# Altium schematic sheet RFID_transmitter_V2.SchDoc
size A
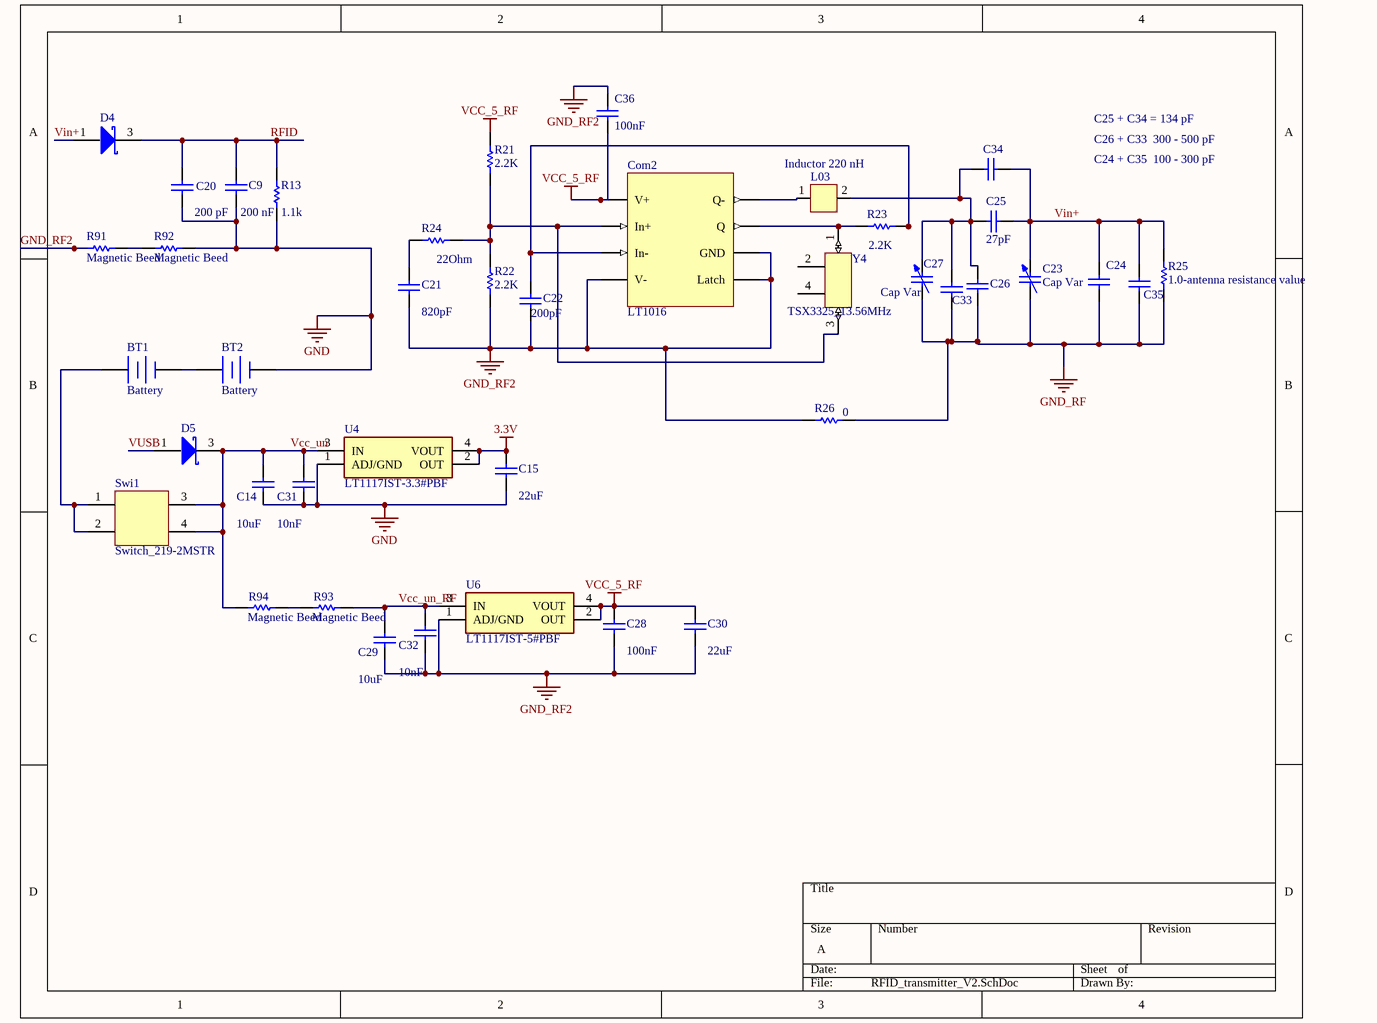
[diagram p0: RFID_transmitter_V2.SchDoc]

## Parts
BT1  Battery  [Battery]
BT2  Battery  [Battery]
C9  value 200 nF  [0603]  (hidden comment: Cap 10n)
C14  value 10uF  [0603]  (hidden comment: Cap 10u)
C15  value 22uF  [0603]  (hidden comment: Cap 22u)
C20  value 200 pF  [0603]  (hidden comment: Cap 4.7n)
C21  value 820pF  [0603]  (hidden comment: Cap 820p)
C22  value 200pF  [0603]  (hidden comment: Cap 200p)
C23  Cap Var  [Variable_Capacitor_JZ400HV1]
C24  Cap  [0603]  (value not drawn)
C25  value 27pF  [0603]  (hidden comment: Cap)
C26  random value needs carefully address  [0603]  (value not drawn)
C27  Cap Var  [Variable_Capacitor_JZ400HV1]
C28  value 100nF  [0603]  (hidden comment: Cap 100n)
C29  value 10uF  [0603]  (hidden comment: Cap 10u)
C30  value 22uF  [0603]  (hidden comment: Cap 22u)
C31  value 10nF  [0603]  (hidden comment: Cap 10n)
C32  value 10nF  [0603]  (hidden comment: Cap 10n)
C33  random value needs carefully address  [0603]  (value not drawn)
C34  Cap  [0603]  (value not drawn)
C35  Cap  [0603]  (value not drawn)
C36  value 100nF  [1608[0603]]  (hidden comment: GRM188R61A226ME15D)
Com2  LT1016  [LT1016_SOIC]
D4  SMMBD301LT3G  [SOT96P237X111-3N]  (value not drawn)
D5  SMMBD301LT3G  [SOT96P237X111-3N]  (value not drawn)
L03  Inductor 220 nH  [Ferrite_bead_0805inch_2012mm]
R13  value 1.1k  [0603]  (hidden comment: Res1)
R21  value 2.2K  [0603]  (hidden comment: Res1 2.2k)
R22  value 2.2K  [0603]  (hidden comment: Res1 2.2k)
R23  value 2.2K  [0603]  (hidden comment: Res1 2.2k)
R24  value 22Ohm  [0603]  (hidden comment: Res1 22)
R25  value 1.0-antenna resistance value  [0603]
R26  value 0  [0603]  (hidden comment: Magnetic Beed)
R91  Magnetic Beed  [0603]
R92  Magnetic Beed  [0603]
R93  Magnetic Beed  [0603]
R94  Magnetic Beed  [0603]
Swi1  Switch_219-2MSTR  [Switch_219-2MSTR]
U4  LT1117IST-3.3#PBF  [SOT230P700X180-4N]
U6  LT1117IST-5#PBF  [SOT230P700X180-4N]
Y4  TSX3325_13.56MHz  [HC_49Crystal]

## Nets
3.3V: C15.2 U4.2(OUT) U4.4(VOUT)
GND: BT2.2(-) C9.1 C14.1 C15.1 C20.1 C31.1 R13.1 R92.2 U4.1(ADJ/GND)
GND_RF: C23.1 C24.1 C26.2 C27.1 C33.2 C35.1 R25.1 R26.2
GND_RF2: C21.1 C22.1 C28.1 C29.1 C30.1 C32.1 C36.2 Com2.4(V-) Com2.5(Latch) Com2.6(GND) R22.1 R26.1 R91.1 U6.1(ADJ/GND)
VCC_5_RF: C28.2 C30.2 C36.1 Com2.1(V+) R21.2 U6.2(OUT) U6.4(VOUT)
RFID: C9.2 C20.2 D4.3(CATHODE) R13.2
Vcc_un: C14.2 C31.2 D5.3(CATHODE) R94.1 Swi1.3(Out1) Swi1.4(Out2) U4.3(IN)
Vcc_un_RF: C29.2 C32.2 R93.2 U6.3(IN)
Vin+: C23.2 C24.2 C25.1 C34.1 C35.2 D4.1(ANODE) R25.2
VUSB: D5.1(ANODE)
NetBT1_1: BT1.1(+) Swi1.1(In1) Swi1.2(In2)
NetBT1_2: BT1.2(-) BT2.1(+)
NetC21_2: C21.2 R24.1
NetC22_2: C22.2 Com2.3(In-) R23.2
NetC25_2: C25.2 C26.1 C27.2 C33.1 C34.2 L03.2
NetCom2_2: Com2.2(In+) R21.1 R22.2 R24.2 Y4.3(Out)
NetCom2_7: Com2.7(Q) R23.1 Y4.1(In)
NetCom2_8: Com2.8(Q-) L03.1
NetR91_2: R91.2 R92.1
NetR93_1: R93.1 R94.2

Not connected (* = marked no-connect by the designer): Y4 2(GND) 4(GND)

## Notes on the sheet
- C25 + C34 = 134 pF
- C26 + C33  300 - 500 pF
- C24 + C35  100 - 300 pF

## Library data of the parts
BT1 BT2 = Battery: Multicell Battery; Published: 24-Mar-1999; LatestRevisionDate: 17-Jul-2002; LatestRevisionNote: Re-released for DXP Platform.; PackageReference: BAT-2; Publisher: Altium Limited; PackageDescription: Battery; 2 Leads
C9 C14 C15 C20-C22 C28-C32 = Cap: Capacitor; Published: 8-Jun-2000; LatestRevisionDate: 17-Jul-2002; LatestRevisionNote: Re-released for DXP Platform.; PackageReference: RAD-0.3; Publisher: Altium Limited; PackageDescription: Radial Cap, Thru-Hole; 2 Leads; 0.3 in Pin Spacing
C23 C27 = Cap Var: Variable or Adjustable Capacitor; Value: 100pF; Published: 24-Mar-1999; LatestRevisionDate: 29-May-2009; LatestRevisionNote: IPC-7351 Footprint Added.; PackageReference: C1210; Publisher: Altium Limited; PackageDescription: Chip Capacitor 1210 Case Size; Code_JEITA: 1210; Code_IPC: CAPC3225
C24 = Cap: Capacitor_for resonance; Value: 22pF; Published: 8-Jun-2000; LatestRevisionDate: 17-Jul-2002; LatestRevisionNote: Re-released for DXP Platform.; PackageReference: RAD-0.3; Publisher: Altium Limited; PackageDescription: Radial Cap, Thru-Hole; 2 Leads; 0.3 in Pin Spacing
C25 = Cap: Capacitor_for resonance; Published: 8-Jun-2000; LatestRevisionDate: 17-Jul-2002; LatestRevisionNote: Re-released for DXP Platform.; PackageReference: RAD-0.3; Publisher: Altium Limited; PackageDescription: Radial Cap, Thru-Hole; 2 Leads; 0.3 in Pin Spacing
C26 = Cap: Capacitor_for resonance; Value: 470pF; Published: 8-Jun-2000; LatestRevisionDate: 17-Jul-2002; LatestRevisionNote: Re-released for DXP Platform.; PackageReference: RAD-0.3; Publisher: Altium Limited; PackageDescription: Radial Cap, Thru-Hole; 2 Leads; 0.3 in Pin Spacing
C33-C35 = Cap: Capacitor_for resonance; Value: 1pF; Published: 8-Jun-2000; LatestRevisionDate: 17-Jul-2002; LatestRevisionNote: Re-released for DXP Platform.; PackageReference: RAD-0.3; Publisher: Altium Limited; PackageDescription: Radial Cap, Thru-Hole; 2 Leads; 0.3 in Pin Spacing
C36 = Cap Semi: Capacitor (Semiconductor SIM Model); Voltage: 10V; Published: 8-Jun-2000; LatestRevisionDate: 29-May-2009; LatestRevisionNote: IPC-7351 Footprint Added.; PackageReference: C1206; Publisher: Altium Limited; PackageDescription: Chip Capacitor
D4 D5 = SMMBD301LT3G: Schottky Barrier Diodes; Manufacturer_Name: ON Semiconductor; Datasheet Link: https://altium.componentsearchengine.com/Datasheets/1/SMMBD301LT3G.pdf; Height: 1.11mm; Manufacturer_Part_Number: SMMBD301LT3G
L03 = Component_1: 220nH
R13 R21-R25 = Res1: Resistor; Published: 8-Jun-2000; LatestRevisionDate: 17-Jul-2002; LatestRevisionNote: Re-released for DXP Platform.; PackageReference: AXIAL-0.3; Publisher: Altium Limited; PackageDescription: Axial Device, Thru-Hole; 2 Leads; 0.3 in Pin Spacing
R26 = Res1: Wurth Magnetic Bead; Published: 8-Jun-2000; LatestRevisionDate: 17-Jul-2002; LatestRevisionNote: Re-released for DXP Platform.; PackageReference: AXIAL-0.3; Publisher: Altium Limited; PackageDescription: Axial Device, Thru-Hole; 2 Leads; 0.3 in Pin Spacing
R91 R92 = Res1: Wurth Magnetic Bead; Value: 0; Published: 8-Jun-2000; LatestRevisionDate: 17-Jul-2002; LatestRevisionNote: Re-released for DXP Platform.; PackageReference: AXIAL-0.3; Publisher: Altium Limited; PackageDescription: Axial Device, Thru-Hole; 2 Leads; 0.3 in Pin Spacing
R93 R94 = Res1: Resistor; Value: 0 Ohm; Published: 8-Jun-2000; LatestRevisionDate: 17-Jul-2002; LatestRevisionNote: Re-released for DXP Platform.; PackageReference: AXIAL-0.3; Publisher: Altium Limited; PackageDescription: Axial Device, Thru-Hole; 2 Leads; 0.3 in Pin Spacing
U4 = LT1117IST-3.3#PBF: Integrated Circuit; Manufacturer_Name: Analog Devices; Datasheet Link: https://www.analog.com/media/en/technical-documentation/data-sheets/1117fd.pdf; Height: 1.8mm; Manufacturer_Part_Number: LT1117IST-3.3#PBF; Mouser Part Number: 584-LT1117IST-3.3PBF
Y4 = TSX3325